# Altium schematic sheet PMIC_V2.SchDoc
size B
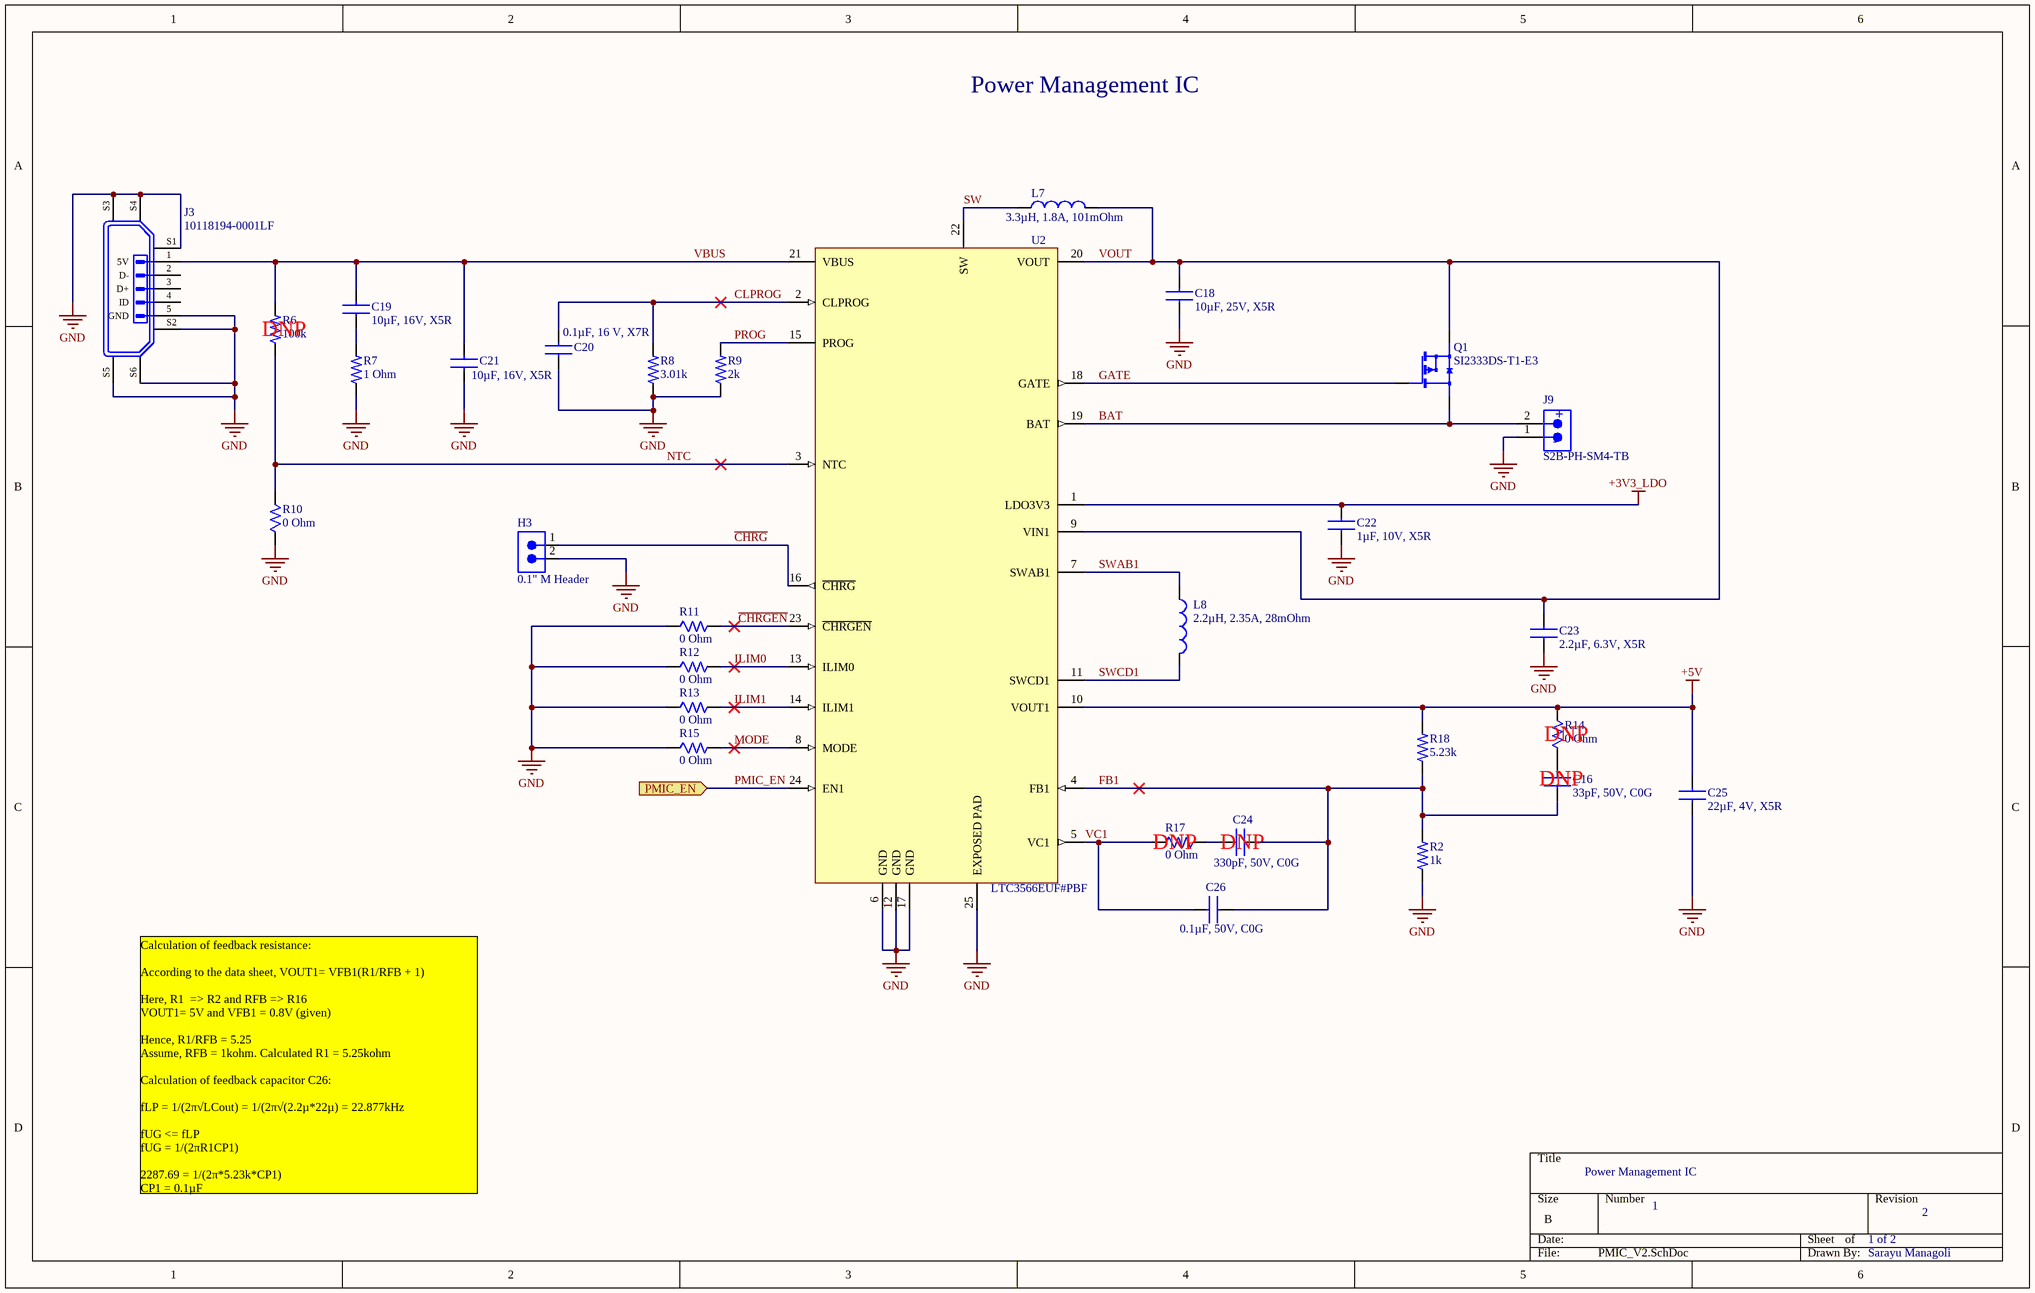
[diagram p0: PMIC_V2.SchDoc]

## Parts
C16  33pF, 50V, C0G  [CAPC2012X09N_39P]
C18  10µF, 25V, X5R  [CAP_2012X14]
C19  10µF, 16V, X5R  [CAP_2012X14]
C20  0.1µF, 16 V, X7R  [CAPC2012X14N]
C21  10µF, 16V, X5R  [CAP_2012X14]
C22  1µF, 10V, X5R  [CAPC2012X14N_1]
C23  2.2µF, 6.3V, X5R  [CAPC2012X14N_2_2]
C24  330pF, 50V, C0G  [CAPC2012X09N_39P]
C25  22µF, 4V, X5R  [CAPC2012X14N_22]
C26  0.1µF, 50V, C0G  [CAPC2012X09N_39P]
H3  0.1" M Header  [77311-118-02LF_AMP]
J3  Manufacturer Part Number: 10118194-0001LF  [micro-USB]  (hidden comment: micro-USB)
J9  S2B-PH-SM4-TB  [S2B-PH-SM4-TB]
L7  3.3µH, 1.8A, 101mOhm  [IND_2828x30]
L8  2.2µH, 2.35A, 28mOhm  [INDP4848X30N_2_2]
Q1  SI2333DS-T1-E3  [SOT95P237X112-3N]
R2  1k  [RESC1609X05N]
R6  100k  [RESC1607X60N]
R7  1 Ohm  [RESC1508X06N]
R8  3.01k  [RESC1608X06N_3K01]
R9  2k  [RESC1508X06N]
R10  0 Ohm  [RES_0_0603]
R11  0 Ohm  [RES_0_0603]
R12  0 Ohm  [RES_0_0603]
R13  0 Ohm  [RES_0_0603]
R14  0 Ohm  [RES_0_0603]
R15  0 Ohm  [RES_0_0603]
R17  0 Ohm  [RES_0_0603]
R18  5.23k  [RES_0603_C1508X06N]
U2  LTC3566EUF#PBF  [QFN50P400X400X80_HS]

## Ports
PMIC_EN (in)

## Nets
+3V3_LDO: C22.1 U2.1(LDO3V3)
+5V: C25.2 R14.2 R18.2 U2.10(VOUT1)
GND: C18.2 C20.2 C21.2 C22.2 C23.1 C25.1 H3.2 J3.5(GND) J3.S1(GND) J3.S2(GND) J3.S3(GND) J3.S4(GND) J3.S5(GND) J3.S6(GND) J9.1(-) R2.1 R7.1 R8.1 R9.1 R10.1 R11.1 R12.1 R13.1 R15.1 U2.6(GND) U2.12(GND) U2.17(GND) U2.25(EXPOSED_PAD)
BAT: J9.2(+) Q1.2 U2.19(BAT)
~{CHRG}: H3.1 U2.16(~{CHRG})
~{CHRGEN}: R11.2 U2.23(~{CHRGEN})
CLPROG: C20.1 R8.2 U2.2(CLPROG)
FB1: C16.2 C24.1 C26.1 R2.2 R18.1 U2.4(FB1)
GATE: Q1.3 U2.18(GATE)
ILIM0: R12.2 U2.13(ILIM0)
ILIM1: R13.2 U2.14(ILIM1)
MODE: R15.2 U2.8(MODE)
NTC: R6.1 R10.2 U2.3(NTC)
PMIC_EN: U2.24(EN1) ; port PMIC_EN
PROG: R9.2 U2.15(PROG)
SW: L7.1 U2.22(SW)
SWAB1: L8.1 U2.7(SWAB1)
SWCD1: L8.2 U2.11(SWCD1)
VBUS: C19.1 C21.1 J3.1(5V) R6.2 U2.21(VBUS)
VC1: C26.2 R17.1 U2.5(VC1)
VOUT: C18.1 C23.2 L7.2 Q1.1 U2.9(VIN1) U2.20(VOUT)
NetC16_1: C16.1 R14.1
NetC19_2: C19.2 R7.2
NetC24_2: C24.2 R17.2

Not connected (* = marked no-connect by the designer): J3 2(D-) 3(D+) 4(ID)

## Notes on the sheet
- Power Management IC
- (near R6) DNP
- (near R14) DNP
- (near C16) DNP
- (near R17) DNP
- (near C24) DNP
- Calculation of feedback resistance:
  According to the data sheet, VOUT1= VFB1(R1/RFB + 1)
  Here, R1  => R2 and RFB => R16
  VOUT1= 5V and VFB1 = 0.8V (given)
  Hence, R1/RFB = 5.25
  Assume, RFB = 1kohm. Calculated R1 = 5.25kohm
  Calculation of feedback capacitor C26:
  fLP = 1/(2π√LCout) = 1/(2π√(2.2µ*22µ) = 22.877kHz
  fUG <= fLP
  fUG = 1/(2πR1CP1)
  2287.69 = 1/(2π*5.23k*CP1)
  CP1 = 0.1µF
- 1
- 1 of 2
- 2
- Sarayu Managoli

## Library data of the parts
C16 = C0805C330J5GACTU: Cap Ceramic 33pF 50V C0G 5% SMD 0805 125C Paper T/R; Manufacturer: KEMET; Dissipation Factor: 0.5%; Temperature Coefficient: 30ppm/°C; Supplier 1: Digi-Key; Manufacturer Part Number: C0805C330J5GACTU; RoHS: Yes; Category: Ceramic Capacitors; Stock 1: 198081; Pricing 1: 1=0.10000, 10=0.06700, 50=0.03640, 100=0.02960, 500=0.02118, 1000=0.01664 (USD); Mount: Surface Mount; Case/Package: 0805; Case Code (Imperial): 0805; Case Code (Metric): 2012; Contact Material: Tin; Dielectric Material: Ceramic; Contact Plating: Tin,Matte; Min Operating Temperature: -55°C; Max Operating Temperature: 125°C; Capacitance: 33pF; Tolerance: 5%; Voltage Rating: 50V; Voltage Rating (DC): 50V; Packaging: Tape and Reel; Package Quantity: 1; Dielectric: C0G; Termination: SMD/SMT; Voltage: 50V; Length: 2mm; Width: 1.2mm; Height: 0.78mm; Lead Pitch: 0.75mm; Thickness: 0.035inch; Depth: 1.25mm; Radiation Hardening: No; REACH SVHC: No SVHC; Lead Free: Lead Free; ComponentLink1URL: https://datasheet.ciiva.com/144/docfinderpartnumber-c0805c330j5gactu-144613.pdf?src-supplier=Digi-Key; ComponentLink1Description: https://datasheet.ciiva.com/144/docfinderpartnumber-c0805c330j5gactu-144613.pdf?src-supplier=Digi-Key; ComponentLink2URL: https://datasheet.ciiva.com/18193/getdatasheetpartid-116050-18193733.pdf?src-supplier=Verical; ComponentLink2Description: https://datasheet.ciiva.com/18193/getdatasheetpartid-116050-18193733.pdf?src-supplier=Verical; ComponentLink3URL: https://datasheet.ciiva.com/28668/1789732-28668774.pdf?src-supplier=Element14; ComponentLink3Description: https://datasheet.ciiva.com/28668/1789732-28668774.pdf?src-supplier=Element14; Supplier Part Number 1: 399-1115-1-ND
C18 = GRM21BR61E106KA73K: CAP CER 10UF 25V X5R 0805; Manufacturer: Murata; Tolerance: 10%; Manufacturer Part Number: GRM21BR61E106KA73K; RoHS: Yes; Category: Ceramic Capacitors; Stock 1: 51226; Pricing 1: 1=0.25000, 10=0.17200, 50=0.10340, 100=0.08740, 500=0.05978, 1000=0.05288, 2500=0.05058, 5000=0.04598 (USD); Mount: Surface Mount; Case/Package: 0805; Weight: 0.000335oz; Min Operating Temperature: -55°C; Max Operating Temperature: 85°C; Dielectric: X5R; Voltage Rating (DC): 25V; Package Quantity: 10000; Packaging: Tape and Reel; Capacitance: 10uF; Voltage Rating: 25V; Length: 0.079inch; Width: 0.049inch; Thickness: 0.055inch; ComponentLink1URL: http://www.mouser.com/ds/2/281/c02e-2905.pdf?src-supplier=Mouser; ComponentLink1Description: http://www.mouser.com/ds/2/281/c02e-2905.pdf?src-supplier=Mouser; ComponentLink2URL: http://search.murata.co.jp/Ceramy/image/img/A01X/G101/ENG/GRM21BR61E106KA73-01.pdf?src-supplier=Digi-Key; ComponentLink2Description: http://search.murata.co.jp/Ceramy/image/img/A01X/G101/ENG/GRM21BR61E106KA73-01.pdf?src-supplier=Digi-Key; ComponentLink3URL: https://search.murata.co.jp/Ceramy/image/img/A01X/G101/ENG/GRM21BR61E106KA73-01.pdf?src-supplier=Digi-Key; ComponentLink3Description: https://search.murata.co.jp/Ceramy/image/img/A01X/G101/ENG/GRM21BR61E106KA73-01.pdf?src-supplier=Digi-Key; Supplier 1: Digi-Key; Supplier Part Number 1: 490-16824-1-ND
C19 C21 = GRM21BR61C106KE15L: CAP CER 10UF 16V X5R 0805; Manufacturer: Murata; Material: Ceramic; Tolerance: 10%; Supplier 1: Digi-Key; Manufacturer Part Number: GRM21BR61C106KE15L; RoHS: Yes; Category: Ceramic Capacitors; Stock 1: 1102233; Pricing 1: 1=0.30000, 10=0.20600, 50=0.13740, 100=0.11680, 500=0.08244, 1000=0.07214 (USD); Mount: Surface Mount; Case/Package: 0805; Case Code (Imperial): 0805; Case Code (Metric): 2012; Min Operating Temperature: -55°C; Max Operating Temperature: 85°C; Packaging: Tape and Reel; Package Quantity: 1; Termination: SMD/SMT; Capacitance: 10uF; Voltage Rating: 16V; Voltage Rating (DC): 16V; Dielectric: X5R; Voltage: 16V; Length: 2mm; Height: 1.25mm; Depth: 1.25mm; Width: 1.25mm; Thickness: 0.053inch; Radiation Hardening: No; REACH SVHC: No SVHC; Lead Free: Lead Free; ComponentLink1URL: https://datasheet.ciiva.com/2989/product-2989696.pdf?src-supplier=Avnet; ComponentLink1Description: https://datasheet.ciiva.com/2989/product-2989696.pdf?src-supplier=Avnet; ComponentLink2URL: https://datasheet.ciiva.com/7719/1747468-7719090.pdf?src-supplier=Element14; ComponentLink2Description: https://datasheet.ciiva.com/7719/1747468-7719090.pdf?src-supplier=Element14; ComponentLink3URL: https://datasheet.ciiva.com/23628/460993-23628598.pdf?src-supplier=Newark; ComponentLink3Description: https://datasheet.ciiva.com/23628/460993-23628598.pdf?src-supplier=Newark; ComponentLink4URL: https://datasheet.ciiva.com/3777/1956grm21br61c106ke1523-3777137.pdf?src-supplier=Arrow+Electronics; ComponentLink4Description: https://datasheet.ciiva.com/3777/1956grm21br61c106ke1523-3777137.pdf?src-supplier=Arrow+Electronics; ComponentLink5URL: https://datasheet.ciiva.com/29202/450891-da-01-de-vs-chip-kond-0805-10-0-uf-10pr-16-0v-x5r-29202696.pdf?src-supplier=Conrad; ComponentLink5Description: https://datasheet.ciiva.com/29202/450891-da-01-de-vs-chip-kond-0805-10-0-uf-10pr-16-0v-x5r-29202696.pdf?src-supplier=Conrad; ComponentLink6URL: https://datasheet.ciiva.com/29199/454607-da-01-en-vs-kondensator-0805-29199611.pdf?src-supplier=Conrad; ComponentLink6Description: https://datasheet.ciiva.com/29199/454607-da-01-en-vs-kondensator-0805-29199611.pdf?src-supplier=Conrad; ComponentLink7URL: https://datasheet.ciiva.com/2989/product-2989697.pdf?src-supplier=Avnet; ComponentLink7Description: https://datasheet.ciiva.com/2989/product-2989697.pdf?src-supplier=Avnet; ComponentLink8URL: https://datasheet.ciiva.com/137/partnumbering-e-01-137917.pdf?src-supplier=Digi-Key; ComponentLink8Description: https://datasheet.ciiva.com/137/partnumbering-e-01-137917.pdf?src-supplier=Digi-Key; ComponentLink9URL: https://datasheet.ciiva.com/137/partnumbering-e-01-137918.pdf?src-supplier=Digi-Key; ComponentLink9Description: https://datasheet.ciiva.com/137/partnumbering-e-01-137918.pdf?src-supplier=Digi-Key; ComponentLink10URL: https://datasheet.ciiva.com/137/partnumbering-e-01-137919.pdf?src-supplier=Digi-Key; ComponentLink10Description: https://datasheet.ciiva.com/137/partnumbering-e-01-137919.pdf?src-supplier=Digi-Key; Supplier Part Number 1: 490-3886-1-ND
C20 = CC0805KRX7R7BB104: YAGEO - CC0805KRX7R7BB104 - SMD Multilayer Ceramic Capacitor, 0.1 µF, 16 V, 0805 [2012 Metric], ± 10%, X7R, CC Series; Capacitance: 100nF; Voltage Rating: 16V; Insulation Resistance: 100GR; Supplier 1: Digi-Key; Manufacturer: Yageo; Manufacturer Part Number: CC0805KRX7R7BB104; RoHS: Yes; Category: Ceramic Capacitors; Stock 1: 224110; Pricing 1: 1=0.12000, 10=0.08500, 50=0.04820, 100=0.03990, 500=0.02794, 1000=0.02314 (USD); Mount: Surface Mount; Case/Package: 0805; Number of Pins: 2; Case Code (Metric): 2012; Case Code (Imperial): 0805; Min Operating Temperature: -55°C; Max Operating Temperature: 125°C; Tolerance: 10%; Voltage Rating (DC): 16V; Packaging: Tape and Reel; Package Quantity: 1; Dielectric: X7R; Termination: SMD/SMT; Resistor Type: Ceramic; Voltage: 16V; Length: 2mm; Width: 0.049inch; Height: 0.85mm; Thickness: 0.033inch; Depth: 1.25mm; Radiation Hardening: No; REACH SVHC: No SVHC; Lead Free: Lead Free; Halogen Free: Halogen Free; ComponentLink1URL: https://datasheet.ciiva.com/8034/1784427-8034017.pdf?src-supplier=Element14; ComponentLink1Description: https://datasheet.ciiva.com/8034/1784427-8034017.pdf?src-supplier=Element14; ComponentLink2URL: https://datasheet.ciiva.com/11786/0900766b80d84f1d-11786102.pdf?src-supplier=RSComponents; ComponentLink2Description: https://datasheet.ciiva.com/11786/0900766b80d84f1d-11786102.pdf?src-supplier=RSComponents; ComponentLink3URL: https://datasheet.ciiva.com/15189/getdatasheetpartid-314877-15189221.pdf?src-supplier=Verical; ComponentLink3Description: https://datasheet.ciiva.com/15189/getdatasheetpartid-314877-15189221.pdf?src-supplier=Verical; ComponentLink4URL: https://datasheet.ciiva.com/144/mlccorderingcode-144998.pdf?src-supplier=Digi-Key; ComponentLink4Description: https://datasheet.ciiva.com/144/mlccorderingcode-144998.pdf?src-supplier=Digi-Key; ComponentLink5URL: https://datasheet.ciiva.com/144/mlccorderingcode-144999.pdf?src-supplier=Digi-Key; ComponentLink5Description: https://datasheet.ciiva.com/144/mlccorderingcode-144999.pdf?src-supplier=Digi-Key; ComponentLink6URL: https://datasheet.ciiva.com/145/mlccorderingcode-145000.pdf?src-supplier=Digi-Key; ComponentLink6Description: https://datasheet.ciiva.com/145/mlccorderingcode-145000.pdf?src-supplier=Digi-Key; ComponentLink7URL: https://datasheet.ciiva.com/11465/upy-gphc-x7r-6-3v-to-50v-8-11465289.pdf?src-supplier=Avnet; ComponentLink7Description: https://datasheet.ciiva.com/11465/upy-gphc-x7r-6-3v-to-50v-8-11465289.pdf?src-supplier=Avnet; ComponentLink8URL: https://datasheet.ciiva.com/17436/upy-gphc-x7r-6-3v-to-50v-8-17436617.pdf?src-supplier=Avnet+Europe; ComponentLink8Description: https://datasheet.ciiva.com/17436/upy-gphc-x7r-6-3v-to-50v-8-17436617.pdf?src-supplier=Avnet+Europe; ComponentLink9URL: https://datasheet.ciiva.com/7978/1489800-7978204.pdf?src-supplier=Element14; ComponentLink9Description: https://datasheet.ciiva.com/7978/1489800-7978204.pdf?src-supplier=Element14; ComponentLink10URL: https://datasheet.ciiva.com/8034/1784427-8034015.pdf?src-supplier=Element14; ComponentLink10Description: https://datasheet.ciiva.com/8034/1784427-8034015.pdf?src-supplier=Element14; Supplier Part Number 1: 311-1142-1-ND
C22 = 0805ZD105KAT2A: CAP CER 1UF 10V X5R 0805; Manufacturer: Kyocera AVX; Tolerance: 10%; Supplier 1: Digi-Key; Manufacturer Part Number: 0805ZD105KAT2A; RoHS: Yes; Category: Ceramic Capacitors; Stock 1: 2747; Pricing 1: 1=0.19000, 10=0.13200, 50=0.07920, 100=0.06690, 500=0.04576, 1000=0.04048 (USD); Mount: Surface Mount; Case/Package: 0805; Number of Pins: 2; Case Code (Metric): 2012; Case Code (Imperial): 0805; Min Operating Temperature: -55°C; Max Operating Temperature: 85°C; Capacitance: 1uF; Dielectric: X5R; Voltage Rating: 10V; Packaging: Tape and Reel; Package Quantity: 2000; Voltage Rating (DC): 10V; Termination: SMD/SMT; Length: 2.01mm; Height: 1.4mm; Depth: 1.25mm; Width: 0.049inch; Thickness: 0.055inch; Radiation Hardening: No; REACH SVHC: No SVHC; Lead Free: Lead Free; ComponentLink1URL: https://datasheet.ciiva.com/19467/1037155-19467690.pdf?src-supplier=Jameco; ComponentLink1Description: https://datasheet.ciiva.com/19467/1037155-19467690.pdf?src-supplier=Jameco; ComponentLink2URL: https://datasheet.ciiva.com/152/cx5r-152610.pdf?src-supplier=Digi-Key; ComponentLink2Description: https://datasheet.ciiva.com/152/cx5r-152610.pdf?src-supplier=Digi-Key; ComponentLink3URL: https://datasheet.ciiva.com/152/cx5r-152611.pdf?src-supplier=Digi-Key; ComponentLink3Description: https://datasheet.ciiva.com/152/cx5r-152611.pdf?src-supplier=Digi-Key; ComponentLink4URL: https://datasheet.ciiva.com/152/cx5r-152612.pdf?src-supplier=Digi-Key; ComponentLink4Description: https://datasheet.ciiva.com/152/cx5r-152612.pdf?src-supplier=Digi-Key; ComponentLink5URL: https://datasheet.ciiva.com/5424/cx5r-33896-5424501.pdf?src-supplier=Mouser; ComponentLink5Description: https://datasheet.ciiva.com/5424/cx5r-33896-5424501.pdf?src-supplier=Mouser; ComponentLink6URL: https://datasheet.ciiva.com/28586/1666675-28586229.pdf?src-supplier=Element14; ComponentLink6Description: https://datasheet.ciiva.com/28586/1666675-28586229.pdf?src-supplier=Element14; ComponentLink7URL: https://datasheet.ciiva.com/28586/1666675-28586885.pdf?src-supplier=Element14; ComponentLink7Description: https://datasheet.ciiva.com/28586/1666675-28586885.pdf?src-supplier=Element14; ComponentLink8URL: https://datasheet.ciiva.com/2988/cx5r-2988073.pdf?src-supplier=Avnet; ComponentLink8Description: https://datasheet.ciiva.com/2988/cx5r-2988073.pdf?src-supplier=Avnet; ComponentLink9URL: https://datasheet.ciiva.com/2988/cx5r-2988074.pdf?src-supplier=Avnet; ComponentLink9Description: https://datasheet.ciiva.com/2988/cx5r-2988074.pdf?src-supplier=Avnet; ComponentLink10URL: https://datasheet.ciiva.com/17494/cx5r-17494091.pdf?src-supplier=Avnet+Europe; ComponentLink10Description: https://datasheet.ciiva.com/17494/cx5r-17494091.pdf?src-supplier=Avnet+Europe; Supplier Part Number 1: 478-1412-1-ND
C23 = 885012107001: CAP CER 2.2UF 6.3V X5R 0805; Manufacturer: Wurth Electronics; Tolerance: 20%; Supplier 1: Digi-Key; Manufacturer Part Number: 885012107001; RoHS: Yes; Category: Ceramic Capacitors; Stock 1: 2091; Pricing 1: 1=0.14000, 10=0.12700, 100=0.11380, 500=0.10068 (USD); Mount: Surface Mount; Case/Package: 0805; Case Code (Imperial): 0805; Case Code (Metric): 2012; Min Operating Temperature: -55°C; Max Operating Temperature: 85°C; Packaging: Tape and Reel; Capacitance: 2.2uF; Voltage Rating: 6.3V; Length: 0.079inch; Width: 0.049inch; Thickness: 0.053inch; ComponentLink1URL: http://www.farnell.com/datasheets/2546749.pdf?src-supplier=Farnell; ComponentLink1Description: http://www.farnell.com/datasheets/2546749.pdf?src-supplier=Farnell; ComponentLink2URL: https://katalog.we-online.de/pbs/datasheet/885012107001.pdf?src-supplier=Digi-Key; ComponentLink2Description: https://katalog.we-online.de/pbs/datasheet/885012107001.pdf?src-supplier=Digi-Key; Supplier Part Number 1: 732-7612-1-ND
C24 = C0805C331K5GACTU: CAP CER 330PF 50V C0G/NP0 0805; Manufacturer: KEMET; Manufacturer Part Number: C0603C331K5GACTU; Dielectric Material: Ceramic; Tolerance: 10%; Dissipation Factor: 0.1%; RoHS: Yes; Category: Ceramic Capacitors; Stock 1: 8890; Pricing 1: 1=0.31000, 10=0.21500, 50=0.14300, 100=0.12160, 500=0.08580, 1000=0.07508 (USD); Mount: Surface Mount; Case/Package: 0603; Case Code (Imperial): 0603; Case Code (Metric): 1608; Min Operating Temperature: -55°C; Max Operating Temperature: 125°C; Capacitance: 330pF; Package Quantity: 1; Voltage Rating: 50V; Packaging: Tape and Reel; Voltage Rating (DC): 50V; Dielectric: C0G; Termination: SMD/SMT; Length: 1.6mm; Width: 0.8mm; Height: 0.8mm; Lead Pitch: 0.7mm; Thickness: 0.034inch; Depth: 0.8mm; Radiation Hardening: No; Lead Free: Lead Free; ComponentLink1URL: http://www.farnell.com/datasheets/2747228.pdf?src-supplier=Farnell; ComponentLink1Description: http://www.farnell.com/datasheets/2747228.pdf?src-supplier=Farnell; ComponentLink2URL: http://www.mouser.com/ds/2/212/KEM_C1003_C0G_SMD-1101588.pdf?src-supplier=Mouser; ComponentLink2Description: http://www.mouser.com/ds/2/212/KEM_C1003_C0G_SMD-1101588.pdf?src-supplier=Mouser; ComponentLink3URL: http://components.arrow.com/part/dataview/0323_00322851?src-supplier=Arrow+Europe; ComponentLink3Description: http://components.arrow.com/part/dataview/0323_00322851?src-supplier=Arrow+Europe; ComponentLink4URL: http://components.arrow.com/part/dataview/2088957S3071164N7429?src-supplier=Arrow+Electronics; ComponentLink4Description: http://components.arrow.com/part/dataview/2088957S3071164N7429?src-supplier=Arrow+Electronics; ComponentLink5URL: http://www.farnell.com/datasheets/2747228.pdf?src-supplier=Element14; ComponentLink5Description: http://www.farnell.com/datasheets/2747228.pdf?src-supplier=Element14; ComponentLink6URL: http://www.farnell.com/datasheets/2747228.pdf?src-supplier=Newark; ComponentLink6Description: http://www.farnell.com/datasheets/2747228.pdf?src-supplier=Newark; ComponentLink7URL: http://capacitoredge.kemet.com/capedge2/DataSheet?pn=C0603C331K5GACTU&src-supplier=Avnet+Europe; ComponentLink7Description: http://capacitoredge.kemet.com/capedge2/DataSheet?pn=C0603C331K5GACTU&src-supplier=Avnet+Europe; ComponentLink8URL: https://search.kemet.com/component-edge/download/datasheet/C0603C331K5GACTU.pdf?src-supplier=Digi-Key; ComponentLink8Description: https://search.kemet.com/component-edge/download/datasheet/C0603C331K5GACTU.pdf?src-supplier=Digi-Key; ComponentLink9URL: http://capacitoredge.kemet.com/capedge2/DataSheet?pn=C0603C331K5GACTU&src-supplier=Avnet; ComponentLink9Description: http://capacitoredge.kemet.com/capedge2/DataSheet?pn=C0603C331K5GACTU&src-supplier=Avnet; Supplier 1: Digi-Key; Supplier Part Number 1: 399-8065-1-ND
C25 = C0805C226K7PAC7800: CAP CER 22UF 4V X5R 0805; Manufacturer: KEMET; Tolerance: 10%; Supplier 1: Digi-Key; Manufacturer Part Number: C0805C226K7PAC7800; RoHS: No; Category: Ceramic Capacitors; Stock 1: 13449; Pricing 1: 1=0.63000, 10=0.44600, 50=0.33700, 100=0.29340, 500=0.21736, 1000=0.18476 (USD); Mount: Surface Mount; Case/Package: 0805; Case Code (Imperial): 0805; Case Code (Metric): 2012; Min Operating Temperature: -55°C; Max Operating Temperature: 85°C; Packaging: Tape and Reel; Capacitance: 22uF; Voltage Rating: 4V; ComponentLink1URL: https://api.kemet.com/component-edge/download/datasheet/C0805C226K7PAC7800.pdf?src-supplier=Digi-Key; ComponentLink1Description: https://api.kemet.com/component-edge/download/datasheet/C0805C226K7PAC7800.pdf?src-supplier=Digi-Key; Supplier Part Number 1: 399-15033-1-ND
C26 = C0805C103J3GACTU: 0805 C 0.1µF Ceramic Multilayer Capacitor; 25 VDC; +125degC; C0G Dielec; +/-5%; Manufacturer: KEMET; Manufacturer Part Number: C0805C390J5GACTU; Tolerance: 5%; Capacitance: 39pF; RoHS: Yes; Category: Ceramic Capacitors; Stock 1: 19514; Pricing 1: 1=0.10000, 10=0.07600, 50=0.04160, 100=0.03400, 500=0.02426, 1000=0.01906 (USD); Mount: Surface Mount; Case/Package: 0805; Dielectric Material: Ceramic; Min Operating Temperature: -55°C; Max Operating Temperature: 125°C; Packaging: Tape and Reel; Dielectric: C0G; Voltage Rating (DC): 50V; Length: 2mm; Height: 0.78mm; Depth: 1.25mm; Radiation Hardening: No; Lead Free: Lead Free; ComponentLink1URL: https://datasheet.ciiva.com/26948/getdatasheetpartid-773240-26948493.pdf?src-supplier=Verical; ComponentLink1Description: https://datasheet.ciiva.com/26948/getdatasheetpartid-773240-26948493.pdf?src-supplier=Verical; ComponentLink2URL: https://datasheet.ciiva.com/7842/1372242-7842601.pdf?src-supplier=Element14; ComponentLink2Description: https://datasheet.ciiva.com/7842/1372242-7842601.pdf?src-supplier=Element14; ComponentLink3URL: https://datasheet.ciiva.com/46393/1791934-46393321.pdf?src-supplier=Element14; ComponentLink3Description: https://datasheet.ciiva.com/46393/1791934-46393321.pdf?src-supplier=Element14; ComponentLink4URL: https://datasheet.ciiva.com/5419/kem-c1003-c0g-smd-356956-5419471.pdf?src-supplier=Mouser; ComponentLink4Description: https://datasheet.ciiva.com/5419/kem-c1003-c0g-smd-356956-5419471.pdf?src-supplier=Mouser; Supplier 1: Digi-Key; Supplier 2: Digi-Key; Supplier Part Number 1: 490-12752-1-ND; Supplier Part Number 2: 399-7990-1-ND
H3 = 77311-118-02LF: Test point; Manufacturer: Amphenol ICC / FCI; Supplier 1: Digi-Key; Manufacturer Part Number: 77311-118-02LF; RoHS: No; Category: Headers and Wire Housings; Stock 1: 29534; Pricing 1: 1=0.19000, 10=0.18200, 100=0.12580, 500=0.10648, 1000=0.08712, 5000=0.07744, 10000=0.07018 (USD); Supplier Part Number 1: 609-4434-ND
J3 = micro-USB: 10118194-0001LF micro-USB paste-in-pad; Manufacturer: FCI; Connector Type: USB - micro B; Number of Contacts: 5; Gender: Receptacle; Specifications: USB 2.0; Current Rating: 1.8 A; Mounting Angle: Right; Insulation Resistance: 1000 MOhms; .Creator: Kailey Shara; .SCHchecked: KS; Supplier 1: Digi-Key; RoHS: RoHS Compliant; Category: Connectors, Interconnects; Stock 1: 27978; Pricing 1: 1=0.46, 10=0.433, 25=0.3712, 50=0.3156, 100=0.3032, 250=0.27224, 500=0.25988 (USD); Packaging: Cut Tape (CT); Mounting Type: Surface Mount, Right Angle, Horizontal; Features: Shielded, Solder Retention; Ingress Protection: -; ComponentLink1URL: http://portal.fciconnect.com/Comergent//fci/drawing/10118194.pdf; ComponentLink1Description: http://portal.fciconnect.com/Comergent//fci/drawing/10118194.pdf; Color: Black; Contact Plating: Gold; Operating Temperature Range: - 55 C to + 85 C; Product: Micro USB Type B Connectors; Termination Style: SMD; Brand: FCI; Contact Material: Copper Alloy; Flammability Rating: UL 94 V-0; Standard: USB 2.0; Standard Pack Qty: 1200; Minimum Order Quantity: 1; Reeling: True; Supplier Part Number 1: 609-4618-1-ND; .PCBchecked: KS
J9 = S2B-PH-SM4-TB(LF)(SN): JST PH Series, 2 Position, Side Entry, 2.00mm, Solder, Surface Mount, Natural; Supplier 1: Digi-Key; Manufacturer: JST; Manufacturer Part Number: S2B-PH-SM4-TB(LF)(SN); Stock 1: 117838; Pricing 1: 1=0.58000, 10=0.54700, 100=0.41940, 500=0.36470 (USD); ComponentLink1URL: http://datasheet.octopart.com/S2B-PH-SM4-TB%28LF%29%28SN%29-JST-datasheet-10411123.pdf?src-supplier=Future+Electronics; ComponentLink1Description: http://datasheet.octopart.com/S2B-PH-SM4-TB%28LF%29%28SN%29-JST-datasheet-10411123.pdf?src-supplier=Future+Electronics; ComponentLink2URL: http://datasheet.octopart.com/S2B-PH-SM4-TB%28LF%29%28SN%29-JST-datasheet-8324864.pdf?src-supplier=Future+Electronics; ComponentLink2Description: http://datasheet.octopart.com/S2B-PH-SM4-TB%28LF%29%28SN%29-JST-datasheet-8324864.pdf?src-supplier=Future+Electronics; ComponentLink3URL: http://datasheet.octopart.com/S2B-PH-SM4-TB%28LF%29%28SN%29-JST-datasheet-15068535.pdf?src-supplier=Newark; ComponentLink3Description: http://datasheet.octopart.com/S2B-PH-SM4-TB%28LF%29%28SN%29-JST-datasheet-15068535.pdf?src-supplier=Newark; ComponentLink4URL: http://datasheet.octopart.com/S2B-PH-SM4-TB%28LF%29%28SN%29-JST-datasheet-56537.pdf?src-supplier=Future+Electronics; ComponentLink4Description: http://datasheet.octopart.com/S2B-PH-SM4-TB%28LF%29%28SN%29-JST-datasheet-56537.pdf?src-supplier=Future+Electronics; ComponentLink5URL: http://datasheet.octopart.com/S2B-PH-SM4-TB%28LF%29%28SN%29-JST-datasheet-515537.pdf?src-supplier=Farnell; ComponentLink5Description: http://datasheet.octopart.com/S2B-PH-SM4-TB%28LF%29%28SN%29-JST-datasheet-515537.pdf?src-supplier=Farnell; ComponentLink6URL: http://datasheet.octopart.com/S2B-PH-SM4-TB%28LF%29%28SN%29-JST-datasheet-12510261.pdf?src-supplier=Future+Electronics; ComponentLink6Description: http://datasheet.octopart.com/S2B-PH-SM4-TB%28LF%29%28SN%29-JST-datasheet-12510261.pdf?src-supplier=Future+Electronics; Supplier Part Number 1: 455-1749-1-ND
L7 = 744025003: WURTH ELEKTRONIK - 744025003 - Leistungsinduktivität (SMD), 3.3 µH, 1.5 A, Geschirmt, 1.8 A, Baureihe WE-TPC; Manufacturer: Wurth Electronics; Core Material: Ferrite; Tolerance: 20%; Current Rating: 1.5A; Shielding: Shielded; Self Resonant Frequency: 100MHz; Inductance: 3.3uH; DC Resistance (DCR): 101mR; Test Frequency: 100kHz; Series Resistance: 85MR; Manufacturer Part Number: 744025003; RoHS: Yes; Category: Fixed Inductors; Stock 1: 2583; Pricing 1: 1=1.54000, 10=1.48000, 50=1.36000, 100=1.13000, 250=1.02000 (USD); Mount: Surface Mount; Case/Package: Nonstandard; Number of Pins: 2; Min Operating Temperature: -40°C; Max Operating Temperature: 125°C; Package Quantity: 1; Packaging: Cut Tape; Saturation Current: 1.8A; Inductance Tolerance: 20%; Resistor Type: Wirewound; Max DC Current: 1.5A; Termination: SMD/SMT; RMS Current (Irms): 1.5A; Length: 2.8mm; Height: 2.8mm; Width: 0.11inch; Height - Seated (Max): 0.118inch; Depth: 2.8mm; REACH SVHC: Unknown; ComponentLink1URL: https://datasheet.ciiva.com/11803/0900766b80f886b5-11803594.pdf?src-supplier=RSComponents; ComponentLink1Description: https://datasheet.ciiva.com/11803/0900766b80f886b5-11803594.pdf?src-supplier=RSComponents; ComponentLink2URL: https://datasheet.ciiva.com/1060/744025003-1060566.pdf?src-supplier=Digi-Key; ComponentLink2Description: https://datasheet.ciiva.com/1060/744025003-1060566.pdf?src-supplier=Digi-Key; ComponentLink3URL: https://datasheet.ciiva.com/4954/744025003-88791-4954796.pdf?src-supplier=Mouser; ComponentLink3Description: https://datasheet.ciiva.com/4954/744025003-88791-4954796.pdf?src-supplier=Mouser; ComponentLink4URL: https://datasheet.ciiva.com/14123/744025003-eng-tds-14123829.pdf?src-supplier=Distrelec; ComponentLink4Description: https://datasheet.ciiva.com/14123/744025003-eng-tds-14123829.pdf?src-supplier=Distrelec; ComponentLink5URL: https://datasheet.ciiva.com/1060/744025003-1060567.pdf?src-supplier=Digi-Key; ComponentLink5Description: https://datasheet.ciiva.com/1060/744025003-1060567.pdf?src-supplier=Digi-Key; ComponentLink6URL: https://datasheet.ciiva.com/1060/744025003-1060568.pdf?src-supplier=Digi-Key; ComponentLink6Description: https://datasheet.ciiva.com/1060/744025003-1060568.pdf?src-supplier=Digi-Key; Supplier 1: Digi-Key; Supplier Part Number 1: 732-2614-1-ND
L8 = 7440430022: WURTH ELEKTRONIK - 7440430022 - Power Inductor (SMD), 2.2 µH, 2.5 A, Shielded, 2.35 A, WE-TPC Series, 4.8mm x 4.8mm x 2.8mm; Manufacturer: Wurth Electronics; Core Material: Ferrite; Current Rating: 2.5A; Tolerance: 30%; Inductance: 2.2uH; Self Resonant Frequency: 100MHz; DC Resistance (DCR): 28mR; Test Frequency: 100kHz; Supplier 1: Digi-Key; Manufacturer Part Number: 7440430022; RoHS: Yes; Category: Fixed Inductors; Stock 1: 4983; Pricing 1: 1=1.43000, 10=1.38900, 50=1.31900, 100=1.21500, 250=1.14600 (USD); Mount: Surface Mount; Case/Package: 1919; Weight: 0.009065oz; Case Code (Metric): 4848; Case Code (Imperial): 1919; Min Operating Temperature: -40°C; Max Operating Temperature: 125°C; Packaging: Tape and Reel; Package Quantity: 500; Termination: SMD/SMT; Saturation Current: 2.35A; Shielding: Shielded; Inductance Tolerance: 30%; Resistor Type: Wirewound; Max DC Current: 2.5A; RMS Current (Irms): 2.5A; Series Resistance: 28mR; Length: 4.8mm; Width: 4.8mm; Height: 2.8mm; Height - Seated (Max): 0.118inch; Depth: 4.8mm; REACH SVHC: Unknown; Lead Free: Lead Free; ComponentLink1URL: https://datasheet.ciiva.com/1075/7440430022-1075984.pdf?src-supplier=Digi-Key; ComponentLink1Description: https://datasheet.ciiva.com/1075/7440430022-1075984.pdf?src-supplier=Digi-Key; ComponentLink2URL: https://datasheet.ciiva.com/23782/1645803-23782392.pdf?src-supplier=Newark; ComponentLink2Description: https://datasheet.ciiva.com/23782/1645803-23782392.pdf?src-supplier=Newark; ComponentLink3URL: https://datasheet.ciiva.com/11803/0900766b80febc3e-11803289.pdf?src-supplier=RSComponents; ComponentLink3Description: https://datasheet.ciiva.com/11803/0900766b80febc3e-11803289.pdf?src-supplier=RSComponents; ComponentLink4URL: https://datasheet.ciiva.com/7754/1735426-7754427.pdf?src-supplier=Element14; ComponentLink4Description: https://datasheet.ciiva.com/7754/1735426-7754427.pdf?src-supplier=Element14; ComponentLink5URL: https://datasheet.ciiva.com/13277/7440430022-66848-13277005.pdf?src-supplier=Mouser; ComponentLink5Description: https://datasheet.ciiva.com/13277/7440430022-66848-13277005.pdf?src-supplier=Mouser; ComponentLink6URL: https://datasheet.ciiva.com/1075/7440430022-1075985.pdf?src-supplier=Digi-Key; ComponentLink6Description: https://datasheet.ciiva.com/1075/7440430022-1075985.pdf?src-supplier=Digi-Key; ComponentLink7URL: https://datasheet.ciiva.com/1075/7440430022-1075986.pdf?src-supplier=Digi-Key; ComponentLink7Description: https://datasheet.ciiva.com/1075/7440430022-1075986.pdf?src-supplier=Digi-Key; ComponentLink8URL: https://datasheet.ciiva.com/48690/001087187-da-01-ml-we-tpc-smd-speicherdrossel-7440430-de-en-48690886.pdf?src-supplier=Conrad; ComponentLink8Description: https://datasheet.ciiva.com/48690/001087187-da-01-ml-we-tpc-smd-speicherdrossel-7440430-de-en-48690886.pdf?src-supplier=Conrad; Supplier Part Number 1: 732-1095-1-ND
Q1 = SI2333DS-T1-E3: Mosfet; Power; P-ch; Vdss -12V; Rds(on) 0.025 Ohm; Id -4.1A; TO-236 (SOT-23); Pd 0.75W; Manufacturer: Vishay Siliconix; Continuous Drain Current (ID): 4.1A; Drain to Source Resistance: 32mR; Gate to Source Voltage (Vgs): 8V; Fall Time: 45ns; Turn-Off Delay Time: 72ns; Threshold Voltage: -1V; Turn-On Delay Time: 25ns; Power Dissipation: 750mW; Input Capacitance: 1.1nF; Number of Elements: 1; Element Configuration: Single; Supplier 1: Digi-Key; Manufacturer Part Number: SI2333DS-T1-E3; RoHS: Yes; Category: MOSFETs; Stock 1: 170951; Pricing 1: 1=0.65000, 10=0.56800, 25=0.53400, 100=0.38750, 500=0.32374, 1000=0.27552 (USD); Mount: Surface Mount; Case/Package: TO-236; Number of Pins: 3; Weight: 0.050717oz; Min Operating Temperature: -55°C; Max Operating Temperature: 150°C; Drain to Source Voltage (Vdss): -12V; Drain to Source Breakdown Voltage: -12V; Nominal Vgs: -1V; On-State Resistance: 32mR; Packaging: Tape and Reel; Rise Time: 45ns; Package Quantity: 3000; Rds On Max: 32mR; Max Power Dissipation: 750mW; Number of Channels: 1; Length: 3.04mm; Height: 1.02mm; Width: 1.4mm; Radiation Hardening: No; REACH SVHC: Unknown; Lead Free: Lead Free; ComponentLink1URL: https://datasheet.ciiva.com/5769/72023-5769120.pdf?src-supplier=Farnell; ComponentLink1Description: https://datasheet.ciiva.com/5769/72023-5769120.pdf?src-supplier=Farnell; ComponentLink2URL: https://datasheet.ciiva.com/4440/72023-244672-4440663.pdf?src-supplier=Mouser; ComponentLink2Description: https://datasheet.ciiva.com/4440/72023-244672-4440663.pdf?src-supplier=Mouser; ComponentLink3URL: https://datasheet.ciiva.com/26790/si2333ds-t1-e3-26790627.pdf?src-supplier=IIIC; ComponentLink3Description: https://datasheet.ciiva.com/26790/si2333ds-t1-e3-26790627.pdf?src-supplier=IIIC; ComponentLink4URL: https://datasheet.ciiva.com/26137/72023-26137974.pdf?src-supplier=Avnet+Europe; ComponentLink4Description: https://datasheet.ciiva.com/26137/72023-26137974.pdf?src-supplier=Avnet+Europe; ComponentLink5URL: https://datasheet.ciiva.com/932/72023-932280.pdf?src-supplier=Digi-Key; ComponentLink5Description: https://datasheet.ciiva.com/932/72023-932280.pdf?src-supplier=Digi-Key; ComponentLink6URL: https://datasheet.ciiva.com/932/72023-932282.pdf?src-supplier=Digi-Key; ComponentLink6Description: https://datasheet.ciiva.com/932/72023-932282.pdf?src-supplier=Digi-Key; ComponentLink7URL: https://datasheet.ciiva.com/11161/72023-11161502.pdf?src-supplier=Avnet; ComponentLink7Description: https://datasheet.ciiva.com/11161/72023-11161502.pdf?src-supplier=Avnet; ComponentLink8URL: https://datasheet.ciiva.com/932/72023-932281.pdf?src-supplier=Digi-Key; ComponentLink8Description: https://datasheet.ciiva.com/932/72023-932281.pdf?src-supplier=Digi-Key; ComponentLink9URL: https://datasheet.ciiva.com/16338/72023-16338653.pdf?src-supplier=Future+Electronics; ComponentLink9Description: https://datasheet.ciiva.com/16338/72023-16338653.pdf?src-supplier=Future+Electronics; Supplier Part Number 1: SI2333DS-T1-E3CT-ND
R2 = CRCW06031K00FKEAC: Res Thick Film 0603 1K Ohm 1% 1/10W ±100ppm/°C Molded SMD SMD T/R; Manufacturer: Vishay; Manufacturer Part Number: CHPHT0603K1001FGT; Voltage Rating: 50V; Resistance: 1kR; Power Rating: 12.5mW; RoHS: Yes; Category: Chip SMD Resistors; Stock 1: 100; Pricing 1: 100=6.69440 (USD); Case/Package: 0603; Case Code (Imperial): 0603; Case Code (Metric): 1608; Contact Plating: Gold; Min Operating Temperature: -55°C; Max Operating Temperature: 230°C; Packaging: Tape and Reel; Package Quantity: 100; Features: Moisture Resistant; Tolerance: 1%; Termination: SMD/SMT; Resistor Type: Thick Film; Number of Terminations: 2; Temperature Coefficient: 100ppm/°C; Max Power Dissipation: 12.5mW; Length: 0.063inch; Height: 0.02inch; Width: 0.9mm; Radiation Hardening: No; ComponentLink1URL: https://datasheet.ciiva.com/16778/70234125-16778296.pdf?src-supplier=Allied+Electronics; ComponentLink1Description: https://datasheet.ciiva.com/16778/70234125-16778296.pdf?src-supplier=Allied+Electronics; ComponentLink2URL: https://datasheet.ciiva.com/2627/chpht-2627389.pdf?src-supplier=Digi-Key; ComponentLink2Description: https://datasheet.ciiva.com/2627/chpht-2627389.pdf?src-supplier=Digi-Key; ComponentLink3URL: https://datasheet.ciiva.com/2627/chpht-2627390.pdf?src-supplier=Digi-Key; ComponentLink3Description: https://datasheet.ciiva.com/2627/chpht-2627390.pdf?src-supplier=Digi-Key; ComponentLink4URL: https://datasheet.ciiva.com/2627/chpht-2627391.pdf?src-supplier=Digi-Key; ComponentLink4Description: https://datasheet.ciiva.com/2627/chpht-2627391.pdf?src-supplier=Digi-Key; Supplier 1: Digi-Key; Supplier Part Number 1: 541-1.00KHCT-ND
R6 = RC0603FR-07100KL: RES SMD 100K OHM 1% 1/10W 0603; Manufacturer: Yageo; Resistance: 100 kOhms; Power Rating: 100 mW; Voltage Rating: 50 V; Temperature Coefficient: 100 PPM / C; Supplier 1: Digi-Key; Supplier Part Number 1: 311-100KHRCT-ND; Manufacturer Part Number: RC0603FR-07100KL; Stock 1: 13478446; Pricing 1: 1=0.1, 10=0.022, 100=0.009, 1000=0.0041, 2500=0.0035 (USD); Termination Style: SMD/SMT; Product: Thick Film Resistors General Purpose; Tolerance: 1 %; Case Code - in: 0603; Case Code - mm: 1608; Series: RC; Operating Temperature Range: - 55 C to + 155 C; Packaging: Reel; ComponentLink1URL: http://www.farnell.com/datasheets/2167052.pdf?src-supplier=Element14; ComponentLink1Description: http://www.farnell.com/datasheets/2167052.pdf?src-supplier=Element14; ComponentLink2URL: http://www.farnell.com/datasheets/1868787.pdf?src-supplier=Element14; ComponentLink2Description: http://www.farnell.com/datasheets/1868787.pdf?src-supplier=Element14; ComponentLink3URL: http://documents.rs-components.com/techlib://itc_doclist_GB.htm?stockno=5048940&src-supplier=RSComponents; ComponentLink3Description: http://documents.rs-components.com/techlib://itc_doclist_GB.htm?stockno=5048940&src-supplier=RSComponents; ComponentLink4URL: http://www.farnell.com/datasheets/443971.pdf?src-supplier=Element14; ComponentLink4Description: http://www.farnell.com/datasheets/443971.pdf?src-supplier=Element14
R7 = RC0603FR-07100RL: YAGEO         RC0603FR-07100RL            RES, THICK FILM, 100R, 1%, 0.1W, 0603, REEL; Voltage Rating (DC): 50V; Power Rating: 100mW; Temperature Coefficient: 100ppm/°C; Supplier 1: Digi-Key; Manufacturer: Yageo; Manufacturer Part Number: RC0603FR-07100RL; RoHS: Yes; Category: Chip SMD Resistors; Stock 1: 5640043; Pricing 1: 1=0.10000, 10=0.02100, 100=0.00850, 1000=0.00382, 2500=0.00331 (USD); Case/Package: 0603; Number of Pins: 2; Case Code (Imperial): 0603; Case Code (Metric): 1608; Min Operating Temperature: -55°C; Max Operating Temperature: 155°C; Resistance: 100R; Tolerance: 1%; Voltage Rating: 50V; Packaging: Tape and Reel; Termination: SMD/SMT; Resistor Type: Thick Film; Length: 1.6mm; Width: 0.8mm; Height: 0.45mm; Depth: 0.8mm; REACH SVHC: Unknown; Lead Free: Lead Free; Military Standard: Not; ComponentLink1URL: https://datasheet.ciiva.com/7660/38590-7660788.pdf?src-supplier=Element14; ComponentLink1Description: https://datasheet.ciiva.com/7660/38590-7660788.pdf?src-supplier=Element14; ComponentLink2URL: https://datasheet.ciiva.com/11808/0900766b80f96399-11808280.pdf?src-supplier=RSComponents; ComponentLink2Description: https://datasheet.ciiva.com/11808/0900766b80f96399-11808280.pdf?src-supplier=RSComponents; ComponentLink3URL: https://datasheet.ciiva.com/46440/1868787-46440890.pdf?src-supplier=Element14; ComponentLink3Description: https://datasheet.ciiva.com/46440/1868787-46440890.pdf?src-supplier=Element14; ComponentLink4URL: https://datasheet.ciiva.com/7746/1738695-7746237.pdf?src-supplier=Element14; ComponentLink4Description: https://datasheet.ciiva.com/7746/1738695-7746237.pdf?src-supplier=Element14; ComponentLink5URL: https://datasheet.ciiva.com/7746/1738695-7746238.pdf?src-supplier=Element14; ComponentLink5Description: https://datasheet.ciiva.com/7746/1738695-7746238.pdf?src-supplier=Element14; ComponentLink6URL: https://datasheet.ciiva.com/22747/443971-22747518.pdf?src-supplier=Element14; ComponentLink6Description: https://datasheet.ciiva.com/22747/443971-22747518.pdf?src-supplier=Element14; Supplier Part Number 1: 311-100HRCT-ND
R8 = RNCS0603BKE3K01: RES SMD 3.01KOHM 0.1% 1/16W 0603; Manufacturer: Stackpole Electronics; Resistance: 3.01kR; Max Power Dissipation: 63mW; Temperature Coefficient: 25ppm/°C; Supplier 1: Digi-Key; Manufacturer Part Number: RNCS0603BKE3K01; RoHS: Yes; Category: Chip SMD Resistors; Stock 1: 9600; Pricing 1: 1=0.45000, 10=0.34500, 100=0.14500 (USD); Mount: Surface Mount; Case/Package: 0603; Case Code (Imperial): 0603; Case Code (Metric): 1608; Contact Plating: Tin,Matte; Min Operating Temperature: -55°C; Max Operating Temperature: 155°C; Tolerance: 0.1%; Packaging: Tape and Reel; Features: Moisture Resistant,Automotive AEC-Q200; Resistor Type: Thin Film; Number of Terminations: 2; Length: 0.061inch; Width: 0.031inch; Height: 0.022inch; Radiation Hardening: No; Lead Free: Lead Free; ComponentLink1URL: https://datasheet.ciiva.com/2528/sei-rncs-rnch-2528531.pdf?src-supplier=Digi-Key; ComponentLink1Description: https://datasheet.ciiva.com/2528/sei-rncs-rnch-2528531.pdf?src-supplier=Digi-Key; ComponentLink2URL: https://datasheet.ciiva.com/2528/sei-rncs-rnch-2528532.pdf?src-supplier=Digi-Key; ComponentLink2Description: https://datasheet.ciiva.com/2528/sei-rncs-rnch-2528532.pdf?src-supplier=Digi-Key; ComponentLink3URL: https://datasheet.ciiva.com/2528/sei-rncs-rnch-2528533.pdf?src-supplier=Digi-Key; ComponentLink3Description: https://datasheet.ciiva.com/2528/sei-rncs-rnch-2528533.pdf?src-supplier=Digi-Key; Supplier Part Number 1: RNCS0603BKE3K01CT-ND
R9 = 9-1879336-1: RES SMD 2K OHM 1% 1/16W 0603; Manufacturer: TE Connectivity; Temperature Coefficient: 50ppm/°C; Resistance: 2kR; Max Power Dissipation: 63mW; Supplier 1: Digi-Key; Manufacturer Part Number: 9-1879336-1; RoHS: Yes; Category: Chip SMD Resistors; Stock 1: 17358; Pricing 1: 1=0.17000, 10=0.14400, 100=0.05630 (USD); Case/Package: 0603; Case Code (Metric): 1608; Case Code (Imperial): 0603; Min Operating Temperature: -55°C; Max Operating Temperature: 155°C; Resistor Type: Thin Film; Number of Terminations: 2; Packaging: Tape and Reel; Tolerance: 1%; Package Quantity: 1000; Length: 0.061inch; Width: 0.031inch; Height: 0.022inch; Depth: 0.8mm; Radiation Hardening: No; Lead Free: Lead Free; Military Standard: Not; ComponentLink1URL: https://datasheet.ciiva.com/2525/eng-cd-1879336-ba1-pdf-c-1879336-drw-2525209.pdf?src-supplier=Digi-Key; ComponentLink1Description: https://datasheet.ciiva.com/2525/eng-cd-1879336-ba1-pdf-c-1879336-drw-2525209.pdf?src-supplier=Digi-Key; Supplier Part Number 1: A102250CT-ND
R10-R15 R17 = RC0603JR-070RL: Jumper, 0 ohm, 0603 [Metrisch 1608], Baureihe RC, 75 V, Dickschicht; Manufacturer: Yageo; Resistance: 0mR; Tolerance: 1%; Power Rating: 100mW; Voltage Rating (DC): 50V; Temperature Coefficient: 200ppm/°C; Supplier 1: Digi-Key; Manufacturer Part Number: RC0603JR-070RL; RoHS: Yes; Category: Chip SMD Resistors; Stock 1: 12794789; Pricing 1: 1=0.10000, 10=0.01700, 25=0.01240, 50=0.00960, 100=0.00700, 250=0.00536, 500=0.00428, 1000=0.00315 (USD); Case/Package: 0603; Number of Pins: 2; Contact Plating: Tin,Matte; Case Code (Imperial): 0603; Case Code (Metric): 1608; Min Operating Temperature: -55°C; Max Operating Temperature: 155°C; Resistor Type: Thick Film; Packaging: Tape and Reel; Termination: SMD/SMT; Package Quantity: 5000; Voltage Rating: 50V; Length: 1.6mm; Height: 0.45mm; Width: 0.8mm; Depth: 0.8mm; Radiation Hardening: No; REACH SVHC: No SVHC; Lead Free: Lead Free; Military Standard: Not; ComponentLink1URL: https://datasheet.ciiva.com/11808/pyu-r-int-6-11808700.pdf?src-supplier=RSComponents; ComponentLink1Description: https://datasheet.ciiva.com/11808/pyu-r-int-6-11808700.pdf?src-supplier=RSComponents; ComponentLink2URL: https://datasheet.ciiva.com/7746/1738695-7746421.pdf?src-supplier=Element14; ComponentLink2Description: https://datasheet.ciiva.com/7746/1738695-7746421.pdf?src-supplier=Element14; ComponentLink3URL: https://datasheet.ciiva.com/8883/pyu-rc0603-51-rohs-l-4-8883045.pdf?src-supplier=Avnet; ComponentLink3Description: https://datasheet.ciiva.com/8883/pyu-rc0603-51-rohs-l-4-8883045.pdf?src-supplier=Avnet; ComponentLink4URL: https://datasheet.ciiva.com/15189/getdatasheetpartid-329462-15189845.pdf?src-supplier=Verical; ComponentLink4Description: https://datasheet.ciiva.com/15189/getdatasheetpartid-329462-15189845.pdf?src-supplier=Verical; ComponentLink5URL: https://datasheet.ciiva.com/7746/1738695-7746422.pdf?src-supplier=Element14; ComponentLink5Description: https://datasheet.ciiva.com/7746/1738695-7746422.pdf?src-supplier=Element14; ComponentLink6URL: https://datasheet.ciiva.com/12555/rc0603-272842-12555254.pdf?src-supplier=Mouser; ComponentLink6Description: https://datasheet.ciiva.com/12555/rc0603-272842-12555254.pdf?src-supplier=Mouser; ComponentLink7URL: https://datasheet.ciiva.com/22747/443971-22747530.pdf?src-supplier=Element14; ComponentLink7Description: https://datasheet.ciiva.com/22747/443971-22747530.pdf?src-supplier=Element14; Supplier Part Number 1: 311-0.0GRCT-ND
R18 = RMCF0603FT5K23: RES SMD 5.23K OHM 1% 1/10W 0603; Manufacturer: Stackpole Electronics; Resistance: 5.23kR; Max Power Dissipation: 100mW; Temperature Coefficient: 100ppm/°C; Supplier 1: Digi-Key; Manufacturer Part Number: RMCF0603FT5K23; RoHS: Yes; Category: Chip SMD Resistors; Stock 1: 51613; Pricing 1: 1=0.10000, 10=0.01500, 100=0.00590, 1000=0.00265, 2500=0.00230 (USD); Mount: Surface Mount; Case/Package: 0603; Contact Plating: Tin,Matte; Case Code (Imperial): 0603; Case Code (Metric): 1608; Min Operating Temperature: -55°C; Max Operating Temperature: 155°C; Features: Automotive AEC-Q200; Tolerance: 1%; Resistor Type: Thick Film; Number of Terminations: 2; Packaging: Tape and Reel; Length: 0.061inch; Height: 0.022inch; Width: 0.031inch; Radiation Hardening: No; Lead Free: Lead Free; ComponentLink1URL: https://www.seielect.com/Catalog/SEI-RMCF_RMCP.pdf?src-supplier=Digi-Key; ComponentLink1Description: https://www.seielect.com/Catalog/SEI-RMCF_RMCP.pdf?src-supplier=Digi-Key; ComponentLink2URL: https://www.seielect.com/catalog/SEI-Packaging.pdf?src-supplier=Digi-Key; ComponentLink2Description: https://www.seielect.com/catalog/SEI-Packaging.pdf?src-supplier=Digi-Key; ComponentLink3URL: https://www.seielect.com/catalog/SEI-RMCF_RMCP.pdf?src-supplier=Avnet; ComponentLink3Description: https://www.seielect.com/catalog/SEI-RMCF_RMCP.pdf?src-supplier=Avnet; Supplier Part Number 1: RMCF0603FT5K23CT-ND
U2 = LTC3566EUF#PBF: IC, BATTERY CHARGER, 1.07A, QFN-24; Manufacturer: Analog Devices / Linear Technology; Number of Cells: 1; Max Input Voltage: 5.5V; Min Input Voltage: 4.35V; Supplier 1: Digi-Key; Manufacturer Part Number: LTC3566EUF#PBF; RoHS: Yes; Category: Battery Management; Stock 1: 211; Pricing 1: 1=9.60000, 25=5.50000, 100=5.30700 (USD); Case/Package: QFN; Number of Pins: 24; Min Operating Temperature: -40°C; Max Operating Temperature: 85°C; Package Quantity: 91; Packaging: Rail/Tube; Number of Outputs: 1; Max Charge Current: 1.07A; Length: 4mm; REACH SVHC: No SVHC; ComponentLink1URL: https://datasheet.ciiva.com/1490/downloaddocument-donavid-h0-c1-c1003-c1037-c1773-p60353-d26142-1490075.pdf?src-supplier=Element14; ComponentLink1Description: https://datasheet.ciiva.com/1490/downloaddocument-donavid-h0-c1-c1003-c1037-c1773-p60353-d26142-1490075.pdf?src-supplier=Element14; ComponentLink2URL: https://datasheet.ciiva.com/1964/26142-1964844.pdf?src-supplier=Digi-Key; ComponentLink2Description: https://datasheet.ciiva.com/1964/26142-1964844.pdf?src-supplier=Digi-Key; Supplier Part Number 1: LTC3566EUF#PBF-ND